# Altium schematic sheet InterfacesA_FPGA.SchDoc
size A; DocumentNumber: 2; SheetNumber: 2
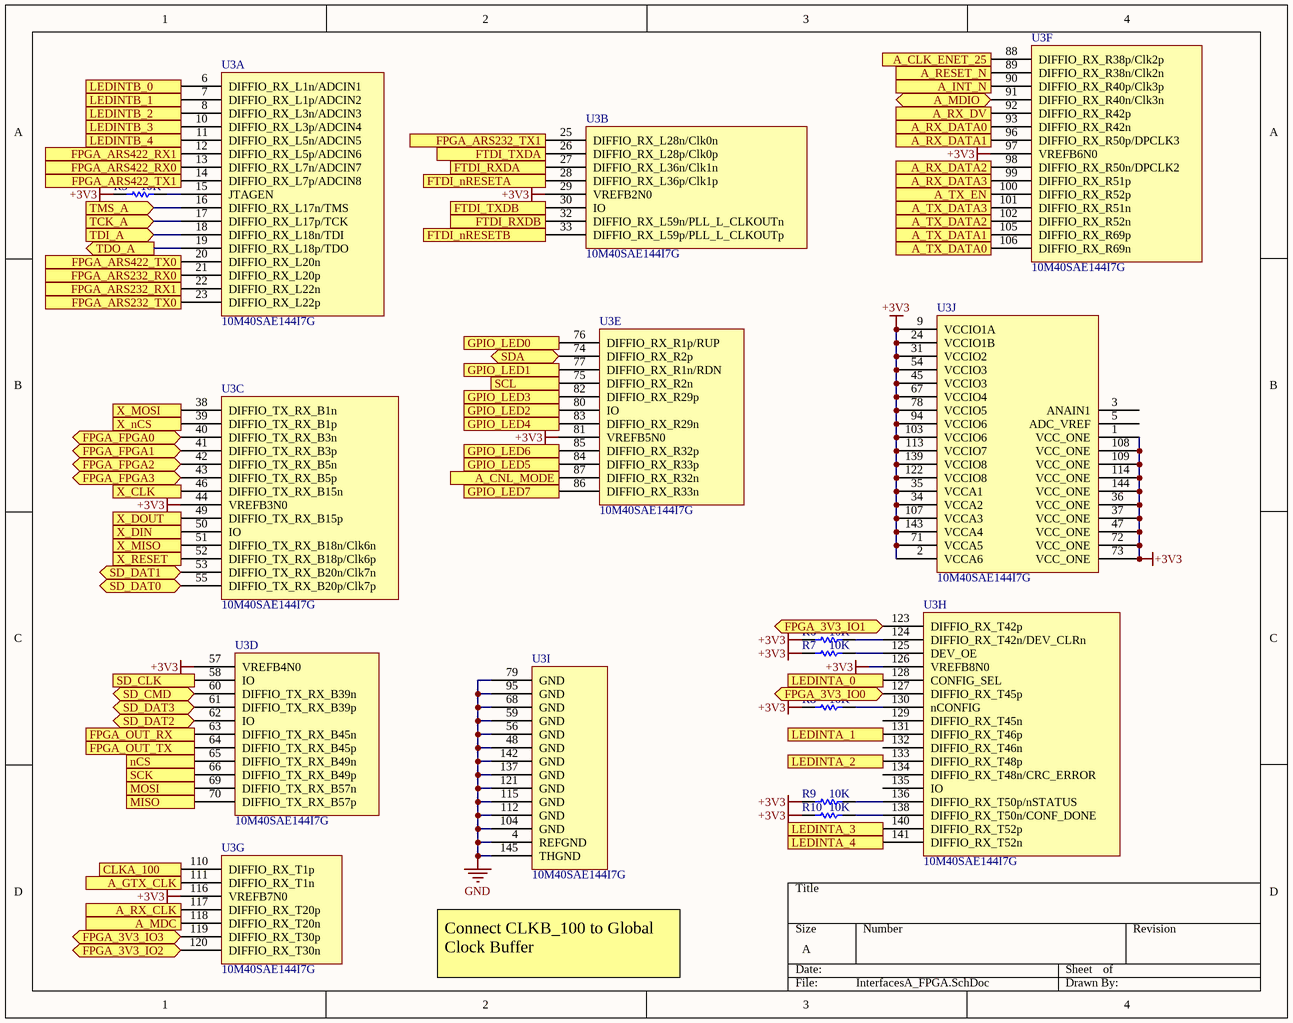
[diagram p0: InterfacesA_FPGA.SchDoc]

## Parts
R5  value 10K  [RES_0805]  (hidden comment: RES_0805)
R6  value 10K  [RES_0805]  (hidden comment: RES_0805)
R7  value 10K  [RES_0805]  (hidden comment: RES_0805)
R8  value 10K  [RES_0805]  (hidden comment: RES_0805)
R9  value 10K  [RES_0805]  (hidden comment: RES_0805)
R10  value 10K  [RES_0805]  (hidden comment: RES_0805)
U3  10M40SAE144I7G  [10M40SAE144I7G]  (parts A,B,C,D,E,F,G,H,I,J of 10)

## Ports
A_CLK_ENET_25 (out), A_CNL_MODE (in), A_GTX_CLK (out), A_INT_N (in), A_MDC (out), A_MDIO (bidir), A_RESET_N (out), A_RX_CLK (out), A_RX_DATA0 (in), A_RX_DATA1 (in), A_RX_DATA2 (in), A_RX_DATA3 (in), A_RX_DV (in), A_TX_DATA0 (out), A_TX_DATA1 (out), A_TX_DATA2 (out), A_TX_DATA3 (out), A_TX_EN (out), CLKA_100 (out), FPGA_3V3_IO0 (bidir), FPGA_3V3_IO1 (bidir), FPGA_3V3_IO2 (bidir), FPGA_3V3_IO3 (bidir), FPGA_ARS232_RX0 (in), FPGA_ARS232_RX1 (in), FPGA_ARS232_TX0 (out), FPGA_ARS232_TX1 (out), FPGA_ARS422_RX0 (in), FPGA_ARS422_RX1 (in), FPGA_ARS422_TX0 (out), FPGA_ARS422_TX1 (out), FPGA_FPGA0 (bidir), FPGA_FPGA1 (bidir), FPGA_FPGA2 (bidir), FPGA_FPGA3 (bidir), FPGA_OUT_RX (in), FPGA_OUT_TX (out), FTDI_nRESETA (out), FTDI_nRESETB (out), FTDI_RXDA (in), FTDI_RXDB (in), FTDI_TXDA (out), FTDI_TXDB (out), GPIO_LED0 (out), GPIO_LED1 (out), GPIO_LED2 (out), GPIO_LED3 (out), GPIO_LED4 (out), GPIO_LED5 (out), GPIO_LED6 (out), GPIO_LED7 (out), LEDINTA_0 (out), LEDINTA_1 (out), LEDINTA_2 (out), LEDINTA_3 (out), LEDINTA_4 (out), LEDINTB_0 (out), LEDINTB_1 (out), LEDINTB_2 (out), LEDINTB_3 (out), LEDINTB_4 (out), MISO (in), MOSI (out), nCS (out), SCK (out), SCL (out), SD_CLK (out), SD_CMD (bidir), SD_DAT0 (bidir), SD_DAT1 (bidir), SD_DAT2 (bidir), SD_DAT3 (bidir), SDA (bidir), TCK_A (in), TDI_A (in), TDO_A (out), TMS_A (in), X_CLK (out), X_DIN (out), X_DOUT (in), X_MISO (in), X_MOSI (out), X_nCS (out), X_RESET (out)

## Nets
+3V3: R5.2 R6.2 R7.2 R8.2 R9.2 R10.2 U3.1(VCC_ONE) U3.2(VCCA6) U3.9(VCCIO1A) U3.24(VCCIO1B) U3.29(VREFB2N0) U3.31(VCCIO2) U3.34(VCCA2) U3.35(VCCA1) U3.36(VCC_ONE) U3.37(VCC_ONE) U3.44(VREFB3N0) U3.45(VCCIO3) U3.47(VCC_ONE) U3.54(VCCIO3) U3.57(VREFB4N0) U3.67(VCCIO4) U3.71(VCCA5) U3.72(VCC_ONE) U3.73(VCC_ONE) U3.78(VCCIO5) U3.81(VREFB5N0) U3.94(VCCIO6) U3.97(VREFB6N0) U3.103(VCCIO6) U3.107(VCCA3) U3.108(VCC_ONE) U3.109(VCC_ONE) U3.113(VCCIO7) U3.114(VCC_ONE) U3.116(VREFB7N0) U3.122(VCCIO8) U3.126(VREFB8N0) U3.139(VCCIO8) U3.143(VCCA4) U3.144(VCC_ONE)
GND: U3.4(REFGND) U3.48(GND) U3.56(GND) U3.59(GND) U3.68(GND) U3.79(GND) U3.95(GND) U3.104(GND) U3.112(GND) U3.115(GND) U3.121(GND) U3.137(GND) U3.142(GND) U3.145(THGND)
A_CLK_ENET_25: U3.88(DIFFIO_RX_R38p/Clk2p) ; port A_CLK_ENET_25
A_CNL_MODE: U3.87(DIFFIO_RX_R32n) ; port A_CNL_MODE
A_GTX_CLK: U3.111(DIFFIO_RX_T1n) ; port A_GTX_CLK
A_INT_N: U3.90(DIFFIO_RX_R40p/Clk3p) ; port A_INT_N
A_MDC: U3.118(DIFFIO_RX_T20n) ; port A_MDC
A_MDIO: U3.91(DIFFIO_RX_R40n/Clk3n) ; port A_MDIO
A_RESET_N: U3.89(DIFFIO_RX_R38n/Clk2n) ; port A_RESET_N
A_RX_CLK: U3.117(DIFFIO_RX_T20p) ; port A_RX_CLK
A_RX_DATA0: U3.93(DIFFIO_RX_R42n) ; port A_RX_DATA0
A_RX_DATA1: U3.96(DIFFIO_RX_R50p/DPCLK3) ; port A_RX_DATA1
A_RX_DATA2: U3.98(DIFFIO_RX_R50n/DPCLK2) ; port A_RX_DATA2
A_RX_DATA3: U3.99(DIFFIO_RX_R51p) ; port A_RX_DATA3
A_RX_DV: U3.92(DIFFIO_RX_R42p) ; port A_RX_DV
A_TX_DATA0: U3.106(DIFFIO_RX_R69n) ; port A_TX_DATA0
A_TX_DATA1: U3.105(DIFFIO_RX_R69p) ; port A_TX_DATA1
A_TX_DATA2: U3.102(DIFFIO_RX_R52n) ; port A_TX_DATA2
A_TX_DATA3: U3.101(DIFFIO_RX_R51n) ; port A_TX_DATA3
A_TX_EN: U3.100(DIFFIO_RX_R52p) ; port A_TX_EN
CLKA_100: U3.110(DIFFIO_RX_T1p) ; port CLKA_100
FPGA_3V3_IO0: U3.127(DIFFIO_RX_T45p) ; port FPGA_3V3_IO0
FPGA_3V3_IO1: U3.123(DIFFIO_RX_T42p) ; port FPGA_3V3_IO1
FPGA_3V3_IO2: U3.120(DIFFIO_RX_T30n) ; port FPGA_3V3_IO2
FPGA_3V3_IO3: U3.119(DIFFIO_RX_T30p) ; port FPGA_3V3_IO3
FPGA_ARS232_RX0: U3.21(DIFFIO_RX_L20p) ; port FPGA_ARS232_RX0
FPGA_ARS232_RX1: U3.22(DIFFIO_RX_L22n) ; port FPGA_ARS232_RX1
FPGA_ARS232_TX0: U3.23(DIFFIO_RX_L22p) ; port FPGA_ARS232_TX0
FPGA_ARS232_TX1: U3.25(DIFFIO_RX_L28n/Clk0n) ; port FPGA_ARS232_TX1
FPGA_ARS422_RX0: U3.13(DIFFIO_RX_L7n/ADCIN7) ; port FPGA_ARS422_RX0
FPGA_ARS422_RX1: U3.12(DIFFIO_RX_L5p/ADCIN6) ; port FPGA_ARS422_RX1
FPGA_ARS422_TX0: U3.20(DIFFIO_RX_L20n) ; port FPGA_ARS422_TX0
FPGA_ARS422_TX1: U3.14(DIFFIO_RX_L7p/ADCIN8) ; port FPGA_ARS422_TX1
FPGA_FPGA0: U3.40(DIFFIO_TX_RX_B3n) ; port FPGA_FPGA0
FPGA_FPGA1: U3.41(DIFFIO_TX_RX_B3p) ; port FPGA_FPGA1
FPGA_FPGA2: U3.42(DIFFIO_TX_RX_B5n) ; port FPGA_FPGA2
FPGA_FPGA3: U3.43(DIFFIO_TX_RX_B5p) ; port FPGA_FPGA3
FPGA_OUT_RX: U3.63(DIFFIO_TX_RX_B45n) ; port FPGA_OUT_RX
FPGA_OUT_TX: U3.64(DIFFIO_TX_RX_B45p) ; port FPGA_OUT_TX
FTDI_nRESETA: U3.28(DIFFIO_RX_L36p/Clk1p) ; port FTDI_nRESETA
FTDI_nRESETB: U3.33(DIFFIO_RX_L59p/PLL_L_CLKOUTp) ; port FTDI_nRESETB
FTDI_RXDA: U3.27(DIFFIO_RX_L36n/Clk1n) ; port FTDI_RXDA
FTDI_RXDB: U3.32(DIFFIO_RX_L59n/PLL_L_CLKOUTn) ; port FTDI_RXDB
FTDI_TXDA: U3.26(DIFFIO_RX_L28p/Clk0p) ; port FTDI_TXDA
FTDI_TXDB: U3.30(IO) ; port FTDI_TXDB
GPIO_LED0: U3.76(DIFFIO_RX_R1p/RUP) ; port GPIO_LED0
GPIO_LED1: U3.77(DIFFIO_RX_R1n/RDN) ; port GPIO_LED1
GPIO_LED2: U3.80(IO) ; port GPIO_LED2
GPIO_LED3: U3.82(DIFFIO_RX_R29p) ; port GPIO_LED3
GPIO_LED4: U3.83(DIFFIO_RX_R29n) ; port GPIO_LED4
GPIO_LED5: U3.84(DIFFIO_RX_R33p) ; port GPIO_LED5
GPIO_LED6: U3.85(DIFFIO_RX_R32p) ; port GPIO_LED6
GPIO_LED7: U3.86(DIFFIO_RX_R33n) ; port GPIO_LED7
LEDINTA_0: U3.128(CONFIG_SEL) ; port LEDINTA_0
LEDINTA_1: U3.131(DIFFIO_RX_T46p) ; port LEDINTA_1
LEDINTA_2: U3.133(DIFFIO_RX_T48p) ; port LEDINTA_2
LEDINTA_3: U3.140(DIFFIO_RX_T52p) ; port LEDINTA_3
LEDINTA_4: U3.141(DIFFIO_RX_T52n) ; port LEDINTA_4
LEDINTB_0: U3.6(DIFFIO_RX_L1n/ADCIN1) ; port LEDINTB_0
LEDINTB_1: U3.7(DIFFIO_RX_L1p/ADCIN2) ; port LEDINTB_1
LEDINTB_2: U3.8(DIFFIO_RX_L3n/ADCIN3) ; port LEDINTB_2
LEDINTB_3: U3.10(DIFFIO_RX_L3p/ADCIN4) ; port LEDINTB_3
LEDINTB_4: U3.11(DIFFIO_RX_L5n/ADCIN5) ; port LEDINTB_4
MISO: U3.70(DIFFIO_TX_RX_B57p) ; port MISO
MOSI: U3.69(DIFFIO_TX_RX_B57n) ; port MOSI
nCS: U3.65(DIFFIO_TX_RX_B49n) ; port nCS
SCK: U3.66(DIFFIO_TX_RX_B49p) ; port SCK
SCL: U3.75(DIFFIO_RX_R2n) ; port SCL
SD_CLK: U3.58(IO) ; port SD_CLK
SD_CMD: U3.60(DIFFIO_TX_RX_B39n) ; port SD_CMD
SD_DAT0: U3.55(DIFFIO_TX_RX_B20p/Clk7p) ; port SD_DAT0
SD_DAT1: U3.53(DIFFIO_TX_RX_B20n/Clk7n) ; port SD_DAT1
SD_DAT2: U3.62(IO) ; port SD_DAT2
SD_DAT3: U3.61(DIFFIO_TX_RX_B39p) ; port SD_DAT3
SDA: U3.74(DIFFIO_RX_R2p) ; port SDA
TCK_A: U3.17(DIFFIO_RX_L17p/TCK) ; port TCK_A
TDI_A: U3.18(DIFFIO_RX_L18n/TDI) ; port TDI_A
TDO_A: U3.19(DIFFIO_RX_L18p/TDO) ; port TDO_A
TMS_A: U3.16(DIFFIO_RX_L17n/TMS) ; port TMS_A
X_CLK: U3.46(DIFFIO_TX_RX_B15n) ; port X_CLK
X_DIN: U3.50(IO) ; port X_DIN
X_DOUT: U3.49(DIFFIO_TX_RX_B15p) ; port X_DOUT
X_MISO: U3.51(DIFFIO_TX_RX_B18n/Clk6n) ; port X_MISO
X_MOSI: U3.38(DIFFIO_TX_RX_B1n) ; port X_MOSI
X_nCS: U3.39(DIFFIO_TX_RX_B1p) ; port X_nCS
X_RESET: U3.52(DIFFIO_TX_RX_B18p/Clk6p) ; port X_RESET
NetR5_1: R5.1 U3.15(JTAGEN)
NetR6_1: R6.1 U3.124(DIFFIO_RX_T42n/DEV_CLRn)
NetR7_1: R7.1 U3.125(DEV_OE)
NetR8_1: R8.1 U3.130(nCONFIG)
NetR9_1: R9.1 U3.136(DIFFIO_RX_T50p/nSTATUS)
NetR10_1: R10.1 U3.138(DIFFIO_RX_T50n/CONF_DONE)

Not connected (* = marked no-connect by the designer): U3 3(ANAIN1) 5(ADC_VREF) 129(DIFFIO_RX_T45n) 132(DIFFIO_RX_T46n) 134(DIFFIO_RX_T48n/CRC_ERROR) 135(IO)

## Notes on the sheet
- Connect CLKB_100 to Global Clock Buffer

## Library data of the parts
U3 = 10M40SAE144I7G: IC FPGA 101 I/O 144EQFP